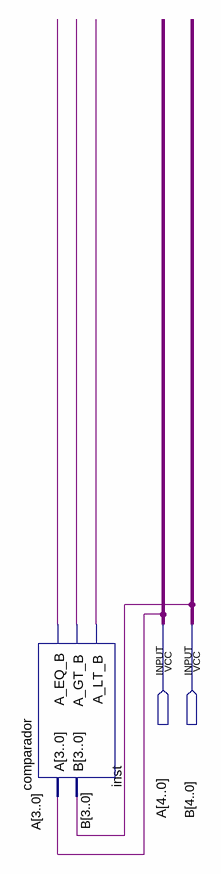
[diagram p0: schematic sheet]
// Quartus schematic comparadorTotal.bdf as structural Verilog: 1 symbols, 2 pins
module comparadorTotal (
  input  [4:0] A,
  input  [4:0] B
);

  wire inst_a_eq_b, inst_a_gt_b, inst_a_lt_b;

  comparador inst (.A(A[3:0]), .B(B[3:0]), .A_EQ_B(inst_a_eq_b), .A_GT_B(inst_a_gt_b), .A_LT_B(inst_a_lt_b));
endmodule
